# EAGLE schematic Node 1 (EAGLE 7.7.0)

## Sheet 1 of 2
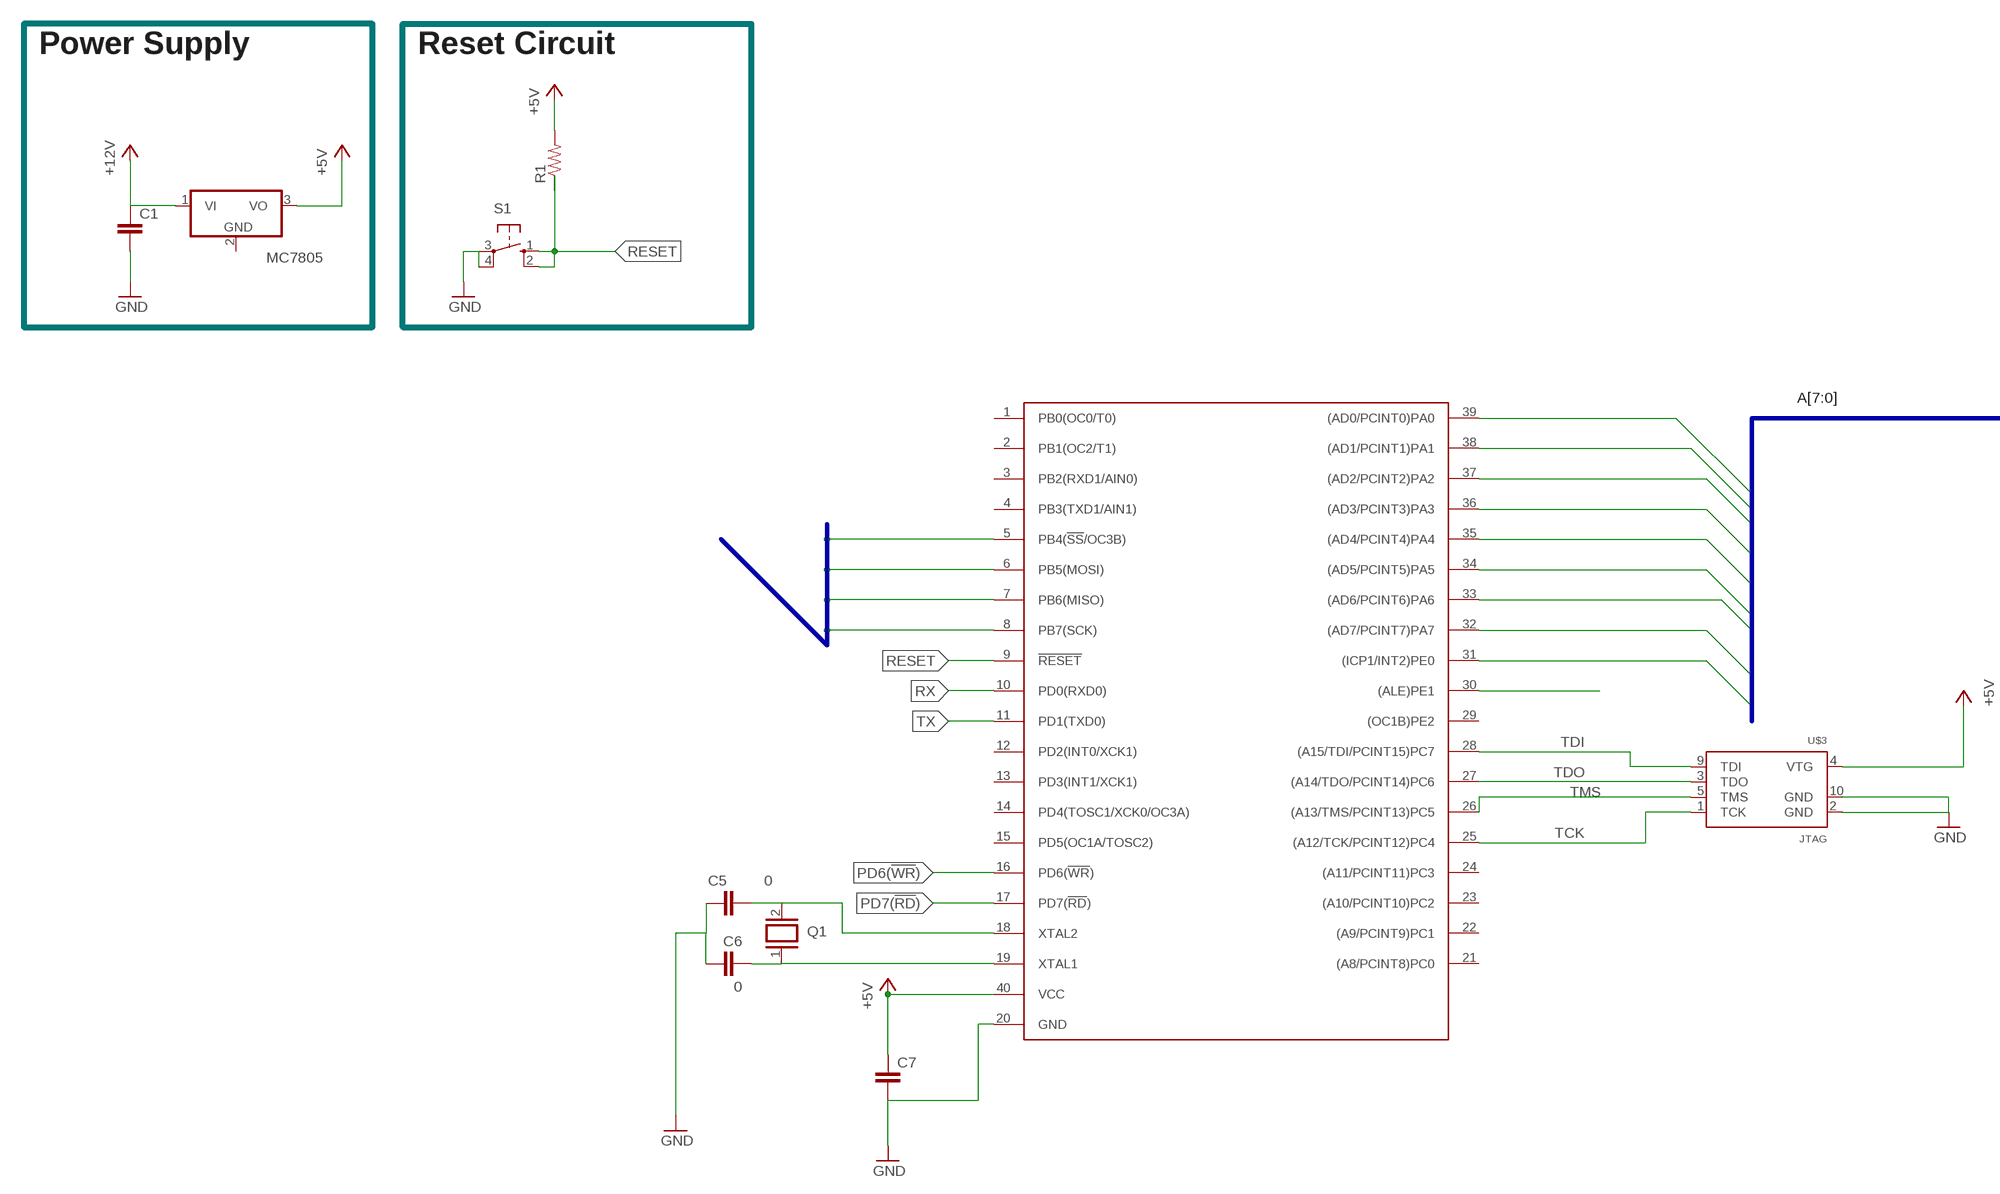
[diagram p0: schematic, sheet 1, part 1 of 2]
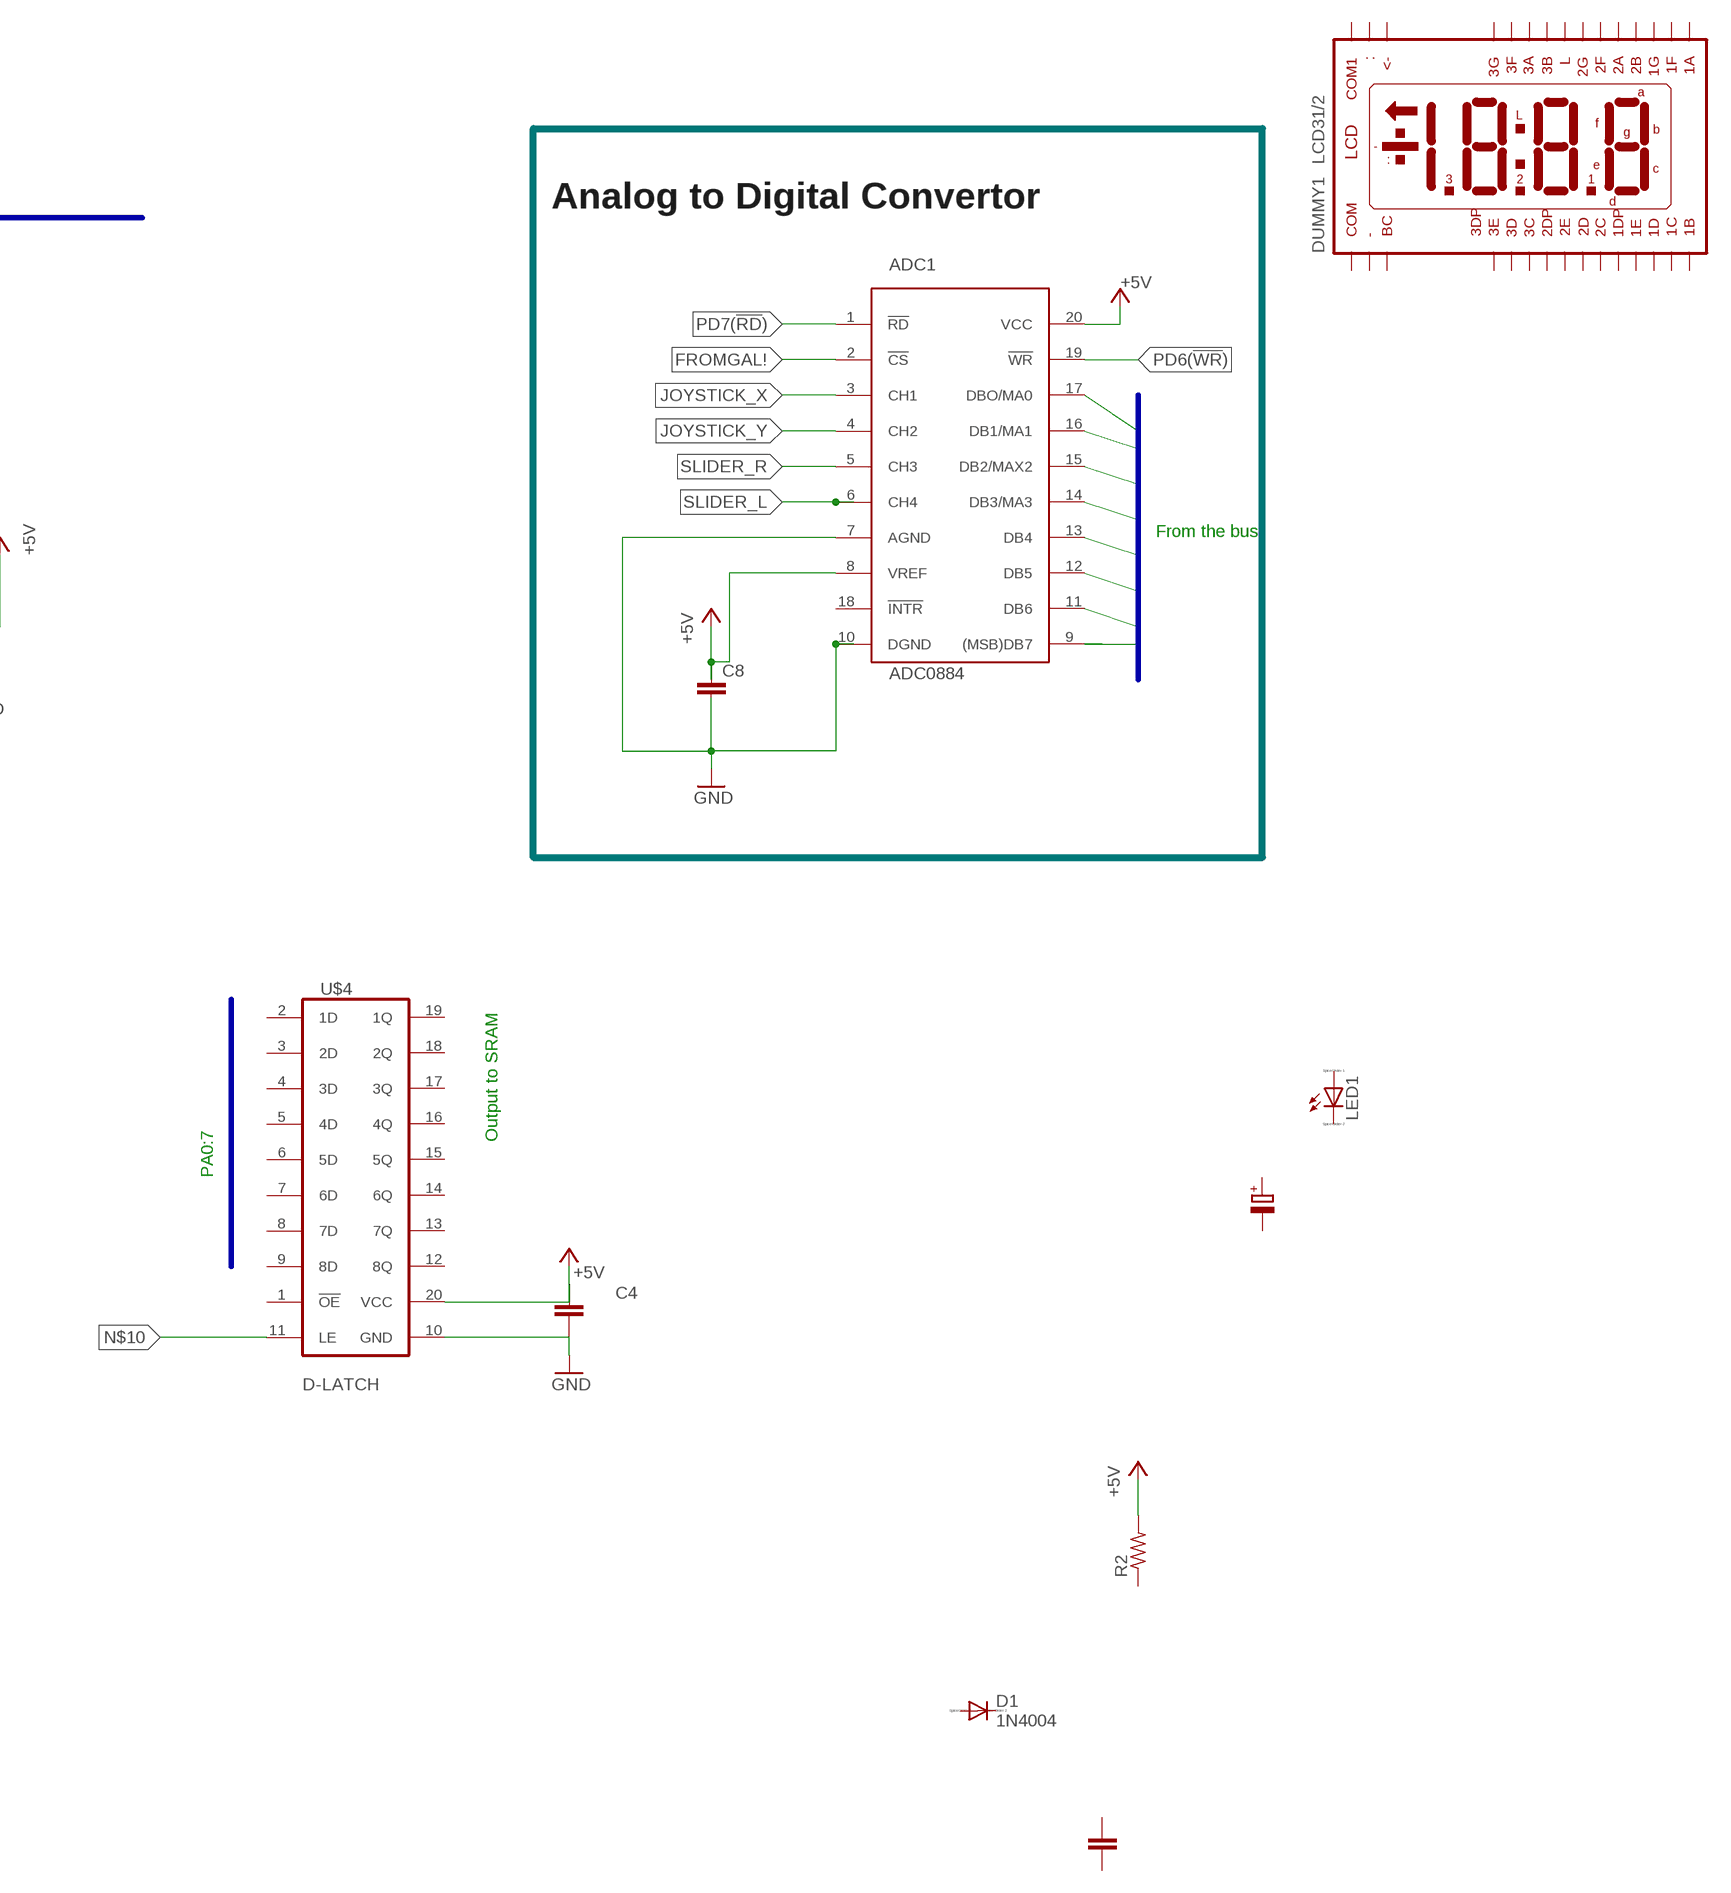
[diagram p1: schematic, sheet 1, part 2 of 2]

### Parts
ADC1  ADC0884  [DIP]
C1  C-EU025-024X044  [C025-024X044]
C4  C-EU025-024X044  [C025-024X044]
C5  0  C-EUC1206  [C1206]
C6  0  C-EUC1206  [C1206]
C7  C-EU025-024X044  [C025-024X044]
C8  C-EU025-024X044  [C025-024X044]
D1  1N4004  [DO41-10]
LED1  LED_E  [LED_1206]
Q1  XTAL/S  [QS]
R1  R-US_0204/2V  [0204V]
R2  R-US_0204/2V  [0204V]
S1  10-XX  [B3F-10XX]
U$1  ATMEGA162  [PDIP40]
U$2  MC7805  [MC7805]
U$3  JTAG  [DIP]
U$4  D-LATCH  [D-LATCH-20]

### Nets
+5V: ADC1.8(VREF) ADC1.20(VCC) C1.1 C4.1 C7.1 C8.1 R1.2 R2.2 U$1.40(VCC) U$2.1(VI) U$2.3(VO) U$3.4(VTG) U$4.20(VCC) ; supply symbol labelled +12V
FROMGAL!: ADC1.2(!CS!)
GND: ADC1.7(AGND) ADC1.10(DGND) C1.2 C4.2 C5.1 C6.1 C7.2 C8.2 S1.3(P) S1.4(P1) U$1.20(GND) U$3.2(GND) U$3.10(GND) U$4.10(GND)
JOYSTICK_X: ADC1.3(CH1)
JOYSTICK_Y: ADC1.4(CH2)
N$1: U$1.6(PB5(MOSI))
N$2: C5.2 Q1.2 U$1.18(XTAL2)
N$3: C6.2 Q1.1 U$1.19(XTAL1)
N$4: U$1.7(PB6(MISO))
N$5: U$1.8(PB7(SCK))
N$6: U$1.5(PB4(!SS!/OC3B))
N$7: U$1.31((ICP1/INT2)PE0)
N$10: U$4.11(LE)
N$11: ADC1.17(DBO/MA0)
N$12: ADC1.16(DB1/MA1)
N$13: ADC1.15(DB2/MAX2)
N$14: ADC1.14(DB3/MA3)
N$15: ADC1.13(DB4)
N$16: ADC1.12(DB5)
N$17: ADC1.11(DB6)
N$18: ADC1.9((MSB)DB7)
N$19: U$1.30((ALE)PE1)
PA0: U$1.39((AD0/PCINT0)PA0)
PA1: U$1.38((AD1/PCINT1)PA1)
PA2: U$1.37((AD2/PCINT2)PA2)
PA3: U$1.36((AD3/PCINT3)PA3)
PA4: U$1.35((AD4/PCINT4)PA4)
PA5: U$1.34((AD5/PCINT5)PA5)
PA6: U$1.33((AD6/PCINT6)PA6)
PA7: U$1.32((AD7/PCINT7)PA7)
PD6(!WR!): ADC1.19(!WR!) U$1.16(PD6(!WR!))
PD7(!RD!): ADC1.1(!RD!) U$1.17(PD7(!RD!))
RESET: R1.1 S1.1(S) S1.2(S1) U$1.9(!RESET!)
RX: U$1.10(PD0(RXD0))
SLIDER_L: ADC1.6(CH4)
SLIDER_R: ADC1.5(CH3)
TCK: U$1.25((A12/TCK/PCINT12)PC4) U$3.1(TCK)
TDI: U$1.28((A15/TDI/PCINT15)PC7) U$3.9(TDI)
TDO: U$1.27((A14/TDO/PCINT14)PC6) U$3.3(TDO)
TMS: U$1.26((A13/TMS/PCINT13)PC5) U$3.5(TMS)
TX: U$1.11(PD1(TXD0))
Unconnected: ADC1.18(!INTR!) D1.A D1.C LED1.A LED1.C R2.1 U$1.1(PB0(OC0/T0)) U$1.2(PB1(OC2/T1)) U$1.3(PB2(RXD1/AIN0)) U$1.4(PB3(TXD1/AIN1)) U$1.12(PD2(INT0/XCK1)) U$1.13(PD3(INT1/XCK1)) U$1.14(PD4(TOSC1/XCK0/OC3A)) U$1.15(PD5(OC1A/TOSC2)) U$1.21((A8/PCINT8)PC0) U$1.22((A9/PCINT9)PC1) U$1.23((A10/PCINT10)PC2) U$1.24((A11/PCINT11)PC3) U$1.29((OC1B)PE2) U$2.2(GND) U$4.1(!OE!) U$4.2(1D) U$4.3(2D) U$4.4(3D) U$4.5(4D) U$4.6(5D) U$4.7(6D) U$4.8(7D) U$4.9(8D) U$4.12(8Q) U$4.13(7Q) U$4.14(6Q) U$4.15(5Q) U$4.16(4Q) U$4.17(3Q) U$4.18(2Q) U$4.19(1Q)

### Buses
B$2
B$1
B$3
B$4

### Notes on the sheet
- Power Supply | Reset Circuit
- Analog to Digital Convertor
- A[7:0]
- From the bus
- Output to SRAM
- PA0:7

## Sheet 2 of 2

## Library data of the parts
ADC1 = Byggern:ADC0884
C1 C4 C7 C8 = resistor:C-EU: CAPACITOR, European symbol
C5 C6 = rcl:C-EU: CAPACITOR, European symbol
D1 = diode:1N4004: DIODE general purpose rectifier, 1 A
LED1 = eagle-ltspice:LED_E: LED Source: http://www.osram.convergy.de Source: www.luxeon.com Source: www.kingbright.com; SPICEMODEL: NONE; SPICEPREFIX: D; SPICETYPE: diode
Q1 = special:XTAL/S: CRYSTAL
R1 R2 = resistor:R-US_: RESISTOR, American symbol
S1 = switch-omron:10-XX: OMRON SWITCH; MPN: B3F-1000; OC_FARNELL: 176432; OC_NEWARK: 36M3542
U$1 = Byggern:ATMEGA162
U$2 = Byggern:MC7805
U$3 = Byggern:JTAG
U$4 = Byggern:D-LATCH

## Net classes
0 default: width 0.3 mm, drill 0.6 mm, clearance 0.2 mm
1 power: width 0.4 mm, drill 0.6 mm, clearance 0.2 mm